# Altium project PCB_Project.PrjPcb
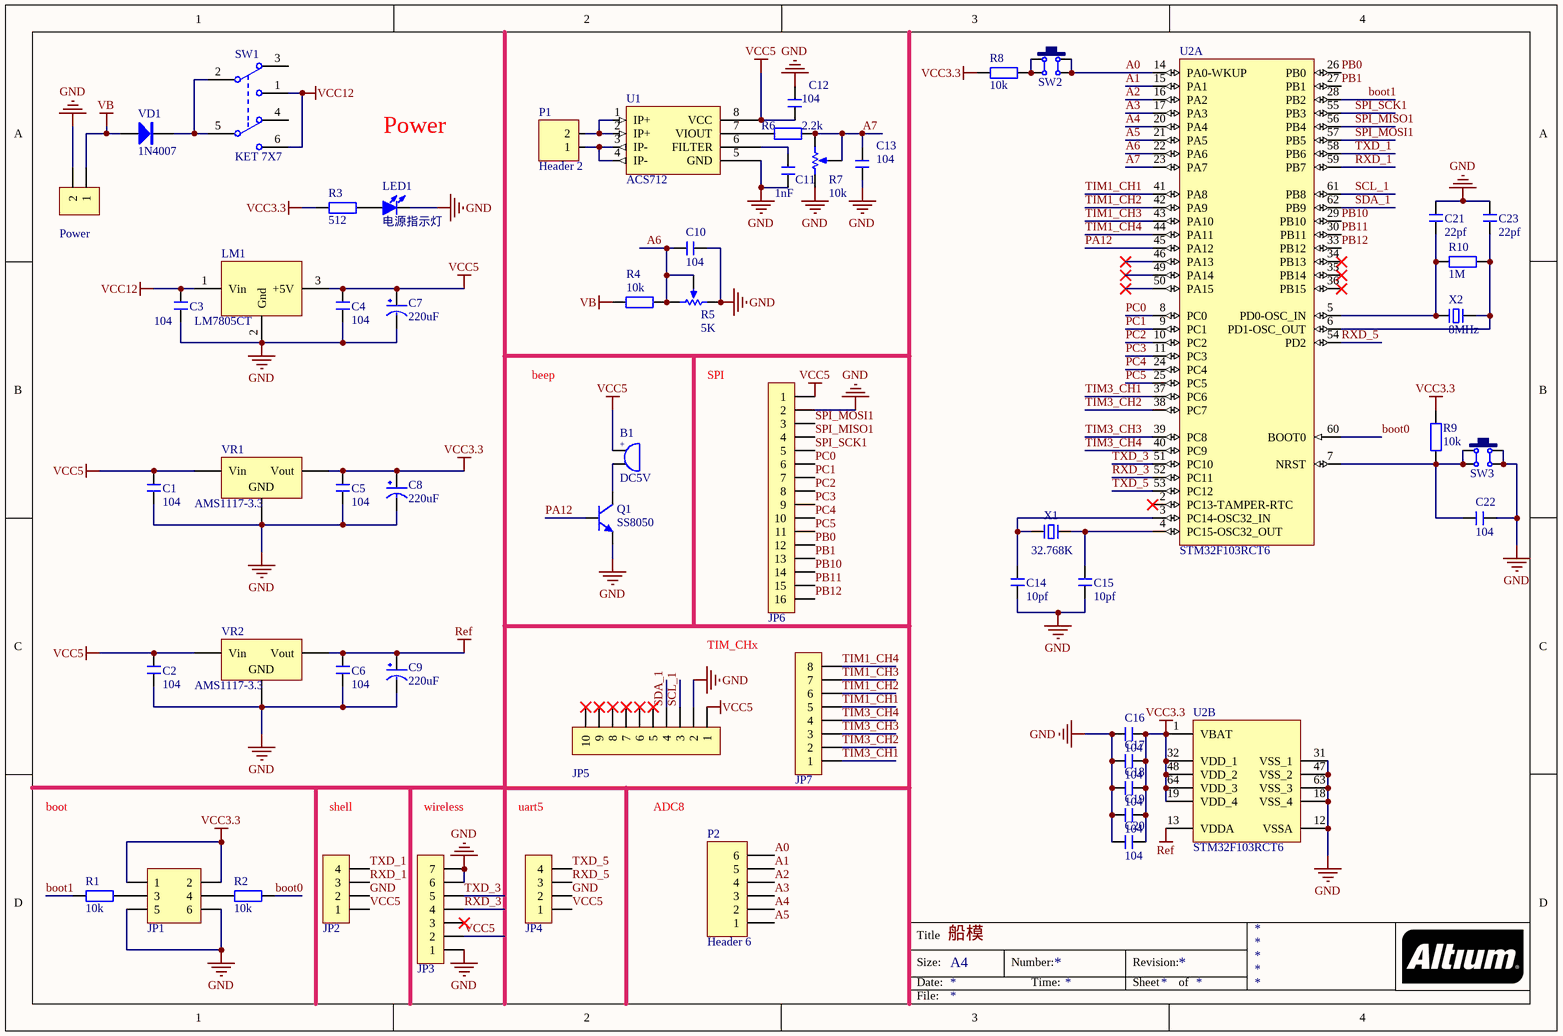
[diagram p0: Sheet1.SchDoc]
1 sheet, 57 parts. Net scope: global (net labels, ports and power ports of the same name join across sheets).
Board file: PCB1.PcbDoc

## Sheet Sheet1.SchDoc: 船模
size A4

### Parts
B1  DC5V  [蜂鸣器]
C1  104  [0805]
C2  104  [0805]
C3  104  [0805]
C4  104  [0805]
C5  104  [0805]
C6  104  [0805]
C7  220uF  [CC6.56.5]
C8  220uF  [CC6.56.5]
C9  220uF  [CC6.56.5]
C10  104  [0805]
C11  1nF  [0805]
C12  104  [0805]
C13  104  [0805]
C14  10pf  [0805]
C15  10pf  [0805]
C16  104  [0805]
C17  104  [0805]
C18  104  [0805]
C19  104  [0805]
C20  104  [0805]
C21  22pf  [0805]
C22  104  [0805]
C23  22pf  [0805]
JP1  Header3X2  [HDR2X3]  (value not drawn)
JP2  HDR-1X4  [HDR1X4]  (value not drawn)
JP3  HDR-1X7  [射频模块]  (value not drawn)
JP4  HDR-1X4  [HDR1X4]  (value not drawn)
JP5  HDR-1X10  [HDR1X10]  (value not drawn)
JP6  HDR-1X16  [HDR1X16]  (value not drawn)
JP7  HDR-1X8  [HDR1X10]  (value not drawn)
LED1  电源指示灯  [5mmLED]
LM1  LM7805CT  [TO254P1524X480-3N]
P1  Header 2  [2p 5.08]
P2  Header 6  [HDR1X6]
Power  HDR-1X2  [2p 5.08]  (value not drawn)
Q1  SS8050  [小功率三极管]
R1  10k  [0805]
R2  10k  [0805]
R3  512  [0805]
R4  10k  [0805]
R5  value 5K  [精密可调电位器]  (hidden comment: RPot)
R6  2.2k  [0805]
R7  value 10k  [精密可调电位器]  (hidden comment: RPot)
R8  10k  [0805]
R9  10k  [0805]
R10  1M  [0805]
SW1  KET 7X7  [BTN8.5*8.5]
SW2  6x6x5  [按钮]  (value not drawn)
SW3  6x6x5  [按钮]  (value not drawn)
U1  ACS712  [SOP8 - duplicate]
U2  STM32F103RCT6  [STM-LQFP64_M]  (parts A,B of 2)
VD1  1N4007  [DIODE_SOP]
VR1  AMS1117-3.3  [SOT-223]
VR2  AMS1117-3.3  [SOT-223]
X1  32.768K  [CAPR5-4X5]
X2  8MHz  [直插晶振]

### Nets
GND: C1.2 C2.2 C3.2 C4.2 C5.2 C6.2 C7.2(GND) C8.2(GND) C9.2(GND) C10.2 C11.2 C12.1 C13.2 C14.1 C15.1 C16.1 C17.1 C18.1 C19.1 C20.1 C21.2 C22.2 C23.2 JP1.5 JP1.6 JP2.2 JP3.1 JP3.6 JP3.7 JP4.2 JP5.2 JP6.2 LED1.2(K) LM1.2(Gnd) Power.2 Q1.1(E) R5.3(TOP) R7.3(TOP) SW3.2 SW3.3 U1.5(GND) U2.12(VSSA) U2.18(VSS_4) U2.31(VSS_1) U2.47(VSS_2) U2.63(VSS_3) VR1.1(GND) VR2.1(GND)
Ref: C6.1 C9.1(VCC) U2.13(VDDA) VR2.2(Vout)
VB: Power.1 R4.1 VD1.1(A)
VCC3.3: C5.1 C8.1(VCC) C16.2 C17.2 C18.2 C19.2 C20.2 JP1.1 JP1.2 R3.1 R8.1 R9.2 U2.1(VBAT) U2.19(VDD_4) U2.32(VDD_1) U2.48(VDD_2) U2.64(VDD_3) VR1.2(Vout)
VCC5: B1.1 C1.1 C2.1 C4.1 C7.1(VCC) C12.2 JP2.1 JP3.2 JP4.1 JP5.1 JP6.1 LM1.3(+5V) U1.8(VCC) VR1.3(Vin) VR2.3(Vin)
VCC12: C3.1 LM1.1(Vin) SW1.1(NC1) SW1.6(NC2)
A0: P2.6 SW2.2 SW2.3 U2.14(PA0-WKUP)
A1: P2.5 U2.15(PA1)
A2: P2.4 U2.16(PA2)
A3: P2.3 U2.17(PA3)
A4: P2.2 U2.20(PA4)
A5: P2.1 U2.21(PA5)
A6: C10.1 R4.2 R5.1(BOT) R5.2(TAP) U2.22(PA6)
A7: C13.1 R6.2 R7.1(BOT) R7.2(TAP) U2.23(PA7)
boot0: R2.1 U2.60(BOOT0)
boot1: R1.1 U2.28(PB2)
PA12: Q1.2(B) U2.45(PA12)
PB0: JP6.12 U2.26(PB0)
PB1: JP6.13 U2.27(PB1)
PB10: JP6.14 U2.29(PB10)
PB11: JP6.15 U2.30(PB11)
PB12: JP6.16 U2.33(PB12)
PC0: JP6.6 U2.8(PC0)
PC1: JP6.7 U2.9(PC1)
PC2: JP6.8 U2.10(PC2)
PC3: JP6.9 U2.11(PC3)
PC4: JP6.10 U2.24(PC4)
PC5: JP6.11 U2.25(PC5)
RXD_1: JP2.3 U2.59(PB7)
RXD_3: JP3.4 U2.52(PC11)
RXD_5: JP4.3 U2.54(PD2)
SCL_1: JP5.3 U2.61(PB8)
SDA_1: JP5.4 U2.62(PB9)
SPI_MISO1: JP6.4 U2.56(PB4)
SPI_MOSI1: JP6.3 U2.57(PB5)
SPI_SCK1: JP6.5 U2.55(PB3)
TIM1_CH1: JP7.5 U2.41(PA8)
TIM1_CH2: JP7.6 U2.42(PA9)
TIM1_CH3: JP7.7 U2.43(PA10)
TIM1_CH4: JP7.8 U2.44(PA11)
TIM3_CH1: JP7.1 U2.37(PC6)
TIM3_CH2: JP7.2 U2.38(PC7)
TIM3_CH3: JP7.3 U2.39(PC8)
TIM3_CH4: JP7.4 U2.40(PC9)
TXD_1: JP2.4 U2.58(PB6)
TXD_3: JP3.5 U2.51(PC10)
TXD_5: JP4.4 U2.53(PC12)
NetB1_2: B1.2 Q1.3(C)
NetC11_1: C11.1 U1.6(FILTER)
NetC14_2: C14.2 U2.3(PC14-OSC32_IN) X1.1
NetC15_2: C15.2 U2.4(PC15-OSC32_OUT) X1.2
NetC21_1: C21.1 R10.1 U2.5(PD0-OSC_IN) X2.1
NetC22_1: C22.1 R9.1 SW3.1 SW3.4 U2.7(NRST)
NetC23_1: C23.1 R10.2 U2.6(PD1-OSC_OUT) X2.2
NetJP1_3: JP1.3 R1.2
NetJP1_4: JP1.4 R2.2
NetLED1_1: LED1.1(A) R3.2
NetP1_1: P1.1 U1.3(IP-) U1.4(IP-)
NetP1_2: P1.2 U1.1(IP+) U1.2(IP+)
NetR6_1: R6.1 U1.7(VIOUT)
NetR8_2: R8.2 SW2.1 SW2.4
NetSW1_2: SW1.2(COM2) SW1.5(COM2) VD1.2(K)

Not connected (* = marked no-connect by the designer): JP3 3*; JP5 5* 6* 7* 8* 9* 10*; SW1 3(NO1) 4(NO2); U2 2(PC13-TAMPER-RTC)* 34(PB13)* 35(PB14)* 36(PB15)* 46(PA13)* 49(PA14)* 50(PA15)*

### Notes on the sheet
- Power
- beep
- SPI
- TIM_CHx
- boot
- shell
- wireless
- uart5
- ADC8
- Title
- Size:
- Date:
- A4
- Number:
- Time:
- Revision:
- Sheet
- of
- File:
- (in symbol BEEP) +

### Library data of the parts
B1 = BEEP: 蜂鸣器; 版权归属: 源创客; BOM名称: 蜂鸣器; 学习资源: www.ooocke.com
C1-C6 C10-C23 = C: 无极性贴片电容; 版权归属: 源创客; BOM名称: 无极性贴片电容; 学习资源: www.ooocke.com
C7-C9 = CAP
JP1 = Header 3X2: 3*2P接插件; 版权归属: 源创客; BOM名称: 3*2P接插件; 学习资源: www.ooocke.com
JP2 JP4 = Header 4: 4P接插件; 版权归属: 源创客; BOM名称: 4P接插件; 学习资源: www.ooocke.com
JP3 = Header 7: 7P接插件; 版权归属: 源创客; BOM名称: 7P接插件; 学习资源: www.ooocke.com
JP5 = Header 10: 10P接插件; 版权归属: 源创客; BOM名称: 10P接插件; 学习资源: www.ooocke.com
JP6 = Header 16: 16P接插件; 版权归属: 源创客; BOM名称: 16P接插件; 学习资源: www.ooocke.com
JP7 = Header 8: 8P接插件; 版权归属: 源创客; BOM名称: 8P接插件; 学习资源: www.ooocke.com
LED1 = LED-3MM: 插件LED; 版权归属: 源创客; BOM名称: 插件LED; 学习资源: www.ooocke.com
P1 = Header 2: Header, 2-Pin; LatestRevisionDate: 17-Jul-2002; LatestRevisionNote: Re-released for DXP Platform.; Publisher: Altium Limited
P2 = Header 6: Header, 6-Pin; LatestRevisionDate: 17-Jul-2002; LatestRevisionNote: Re-released for DXP Platform.; Publisher: Altium Limited
Power = Header 2: 2P接插件; 版权归属: 源创客; BOM名称: 2P接插件; 学习资源: www.ooocke.com
Q1 = 8050-DIP: 高频放大-NPN型; 版权归属: 源创客; 属性: 40V 1.5A 1W 100MHZ; BOM名称: 高频放大-NPN型; 学习资源: www.ooocke.com
R1-R4 R6 R8-R10 = R: 贴片电阻; 版权归属: 源创客; BOM名称: 贴片电阻; 学习资源: www.ooocke.com
R5 R7 = RPot: Potentiometer; Sim Note: Enter the Resistance value and the set point into parameter fields.; Set Position: 0.5; Published: 8-Jun-2000; LatestRevisionDate: 17-Jul-2002; LatestRevisionNote: Re-released for DXP Platform.; PackageReference: VR5; Publisher: Altium Limited
SW1 = KET 7X7: 7*7自锁开关; 版权归属: 源创客; BOM名称: 7*7自锁开关; 学习资源: www.ooocke.com
SW2 SW3 = TSW DIP-6x6: 直插6x6轻触开关; 版权归属: 源创客; BOM名称: 直插6x6轻触开关; 学习资源: www.ooocke.com
U2 = STM32F103RCT6: ARM Cortex-M3 32-bit MCU, 256 KB Flash, 48 KB Internal RAM, 51 I/Os, 64-pin LQFP, -40 to 85 degC, Tray; A/D Converter: 3x12-bit (16 Channel); D/A Converter: 2x12-bit (2 Channel); FLASH Size (Prog) (kB): 256; I/Os (High Current): 51; Internal RAM Size (kB): 48; Operating Frequency(F) (Processor speed) (MHz): 72; Supply Voltage(Vcc) min (V): 2; DatasheetVersion: Rev. 8; PackageVersion: Rev. 4, 06/2013; PackageReference: LQFP64; PackageDescription: 64-Pin Low Profile Quad Flat Package, 10 x 10 mm Body, 0.5 mm Pitch; Supplier 1: Digi-Key; Supplier Part Number 1: 497-9033-ND; Supplier 2: Newark; Supplier Part Number 2: 01P4099; Supplier 3: Newark; Supplier Part Number 3: 57P1227; Supplier 4: Mouser; Supplier Part Number 4: 511-STM32F103RCT6; Core: ARM Cortex-M3; Packing: Tray; Mounting Technology: Surface Mount; PartNumber: STM32F103RCT6; ComponentLink1Description: Manufacturer URL; ComponentLink1URL: http://www.st.com/web/en/home.html; ComponentLink2Description: Datasheet; ComponentLink2URL: http://www.st.com/st-web-ui/static/active/en/resource/technical/document/datasheet/CD00191185.pdf; ComponentLink3Description: Package Specification; ComponentLink3URL: http://www.st.com/st-web-ui/static/active/en/resource/technical/document/datasheet/DM00037051.pdf
VD1 = 1N4007: 整流二极管; 版权归属: 源创客; BOM名称: 整流二极管; 学习资源: www.ooocke.com
VR1 VR2 = SOT-223 AMS1117-3.3: 低压差线性稳压(LDO); ComponentLink1Description: 供应商链接; ComponentLink1URL: http://www.szlcsc.com/product/details_6652.html; Package: SOT-223; Supplier: LC; SuppliersPartNumber: C6186
X1 X2 = XTAL-2: 2脚晶振; 版权归属: 源创客; BOM名称: 2脚晶振; 学习资源: www.ooocke.com